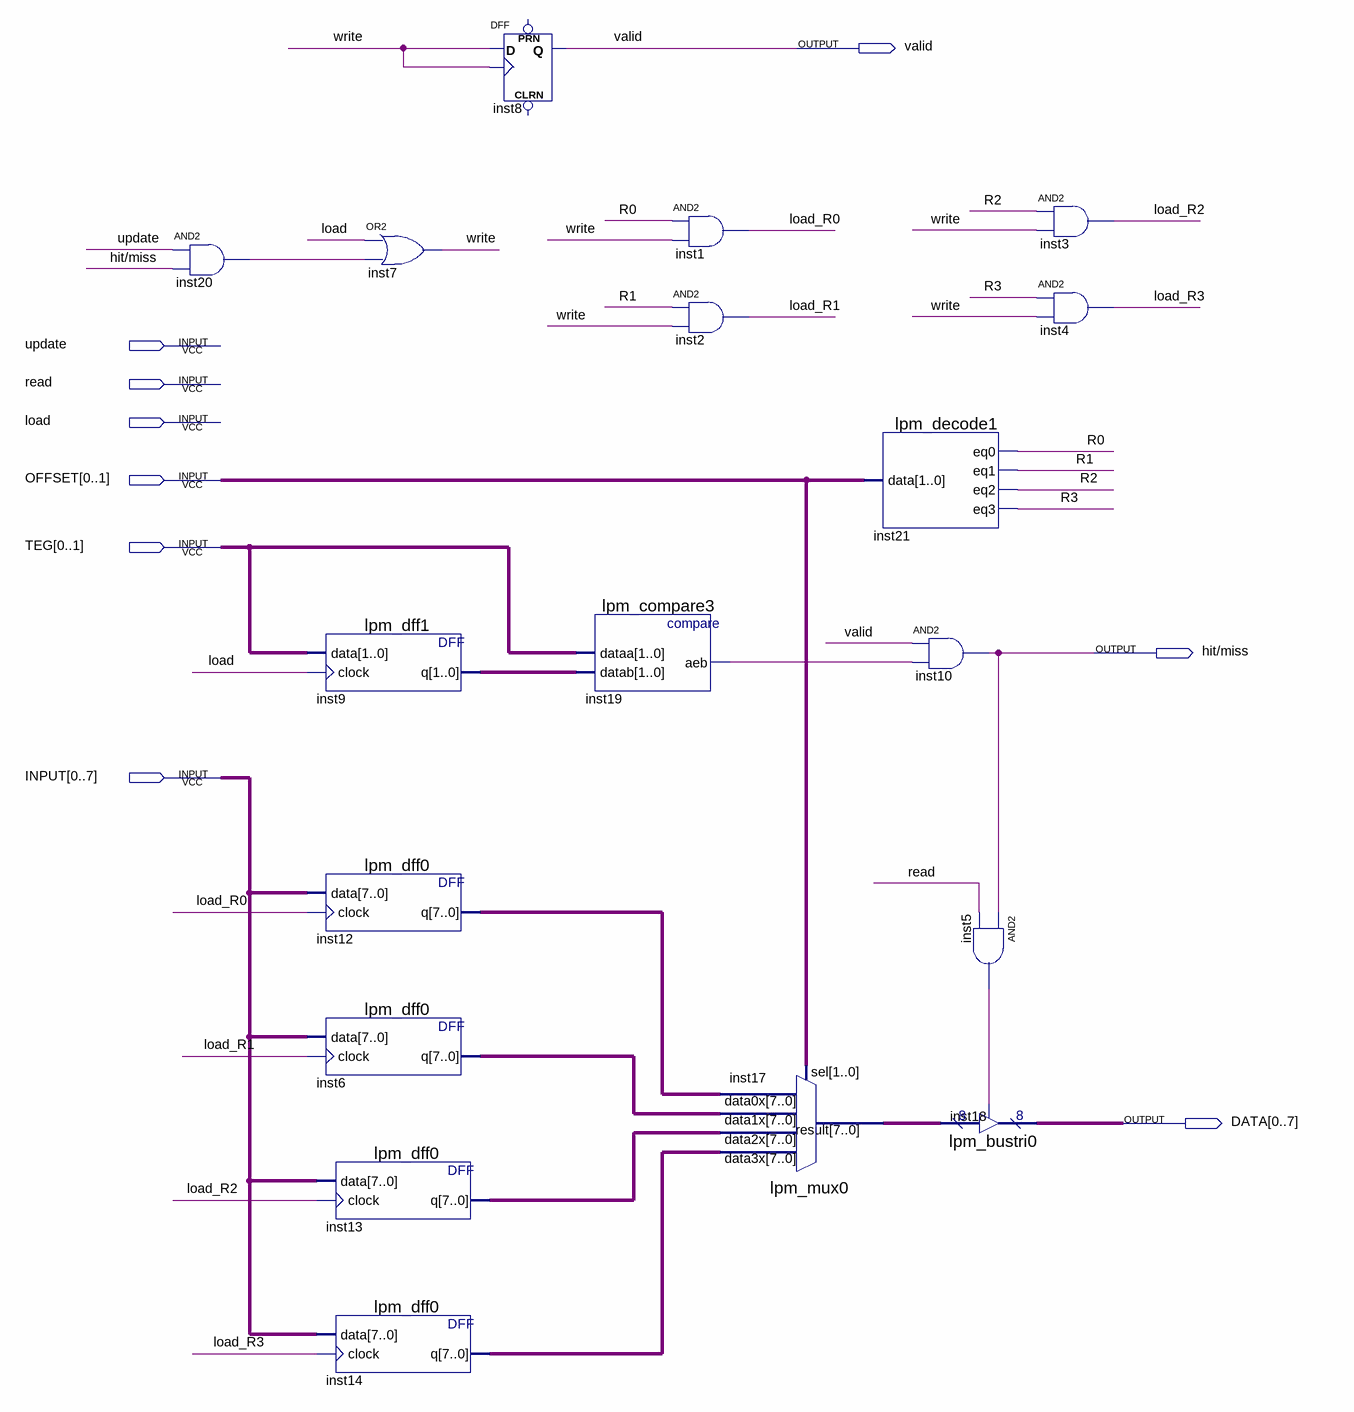
[diagram p0: schematic sheet]
// Quartus schematic ROW.bdf as structural Verilog: 18 symbols, 9 pins
module ROW (
  input  update,
  input  read,
  input  load,
  input  [0:1] OFFSET,
  input  [0:1] TEG,
  input  [0:7] INPUT,
  output valid,
  output \hit/miss ,
  output [0:7] DATA
);

  wire inst5_out, inst19_aeb, inst20_out, load_R0, load_R1, load_R2, load_R3, R0, R1, R2, R3, write;
  wire [1:0] inst9_q;
  wire [7:0] inst6_q, inst12_q, inst13_q, inst14_q, inst17_result;

  and inst20 (inst20_out, update, \hit/miss );
  or inst7 (write, load, inst20_out);
  lpm_dff1 inst9 (.data(TEG), .clock(load), .q(inst9_q));
  lpm_dff0 inst12 (.data(INPUT), .clock(load_R0), .q(inst12_q));
  lpm_dff0 inst6 (.data(INPUT), .clock(load_R1), .q(inst6_q));
  lpm_dff0 inst13 (.data(INPUT), .clock(load_R2), .q(inst13_q));
  lpm_dff0 inst14 (.data(INPUT), .clock(load_R3), .q(inst14_q));
  DFF inst8 (.CLK(write), .D(write), .Q(valid));  // open: CLRN, PRN
  lpm_compare3 inst19 (.dataa(TEG), .datab(inst9_q), .aeb(inst19_aeb));
  and inst1 (load_R0, R0, write);
  and inst2 (load_R1, R1, write);
  lpm_mux0 inst17 (
    .data3x(inst14_q), .data2x(inst13_q), .data1x(inst6_q), .data0x(inst12_q), .sel(OFFSET),
    .result(inst17_result));
  lpm_decode1 inst21 (.data(OFFSET), .eq0(R0), .eq1(R1), .eq2(R2), .eq3(R3));
  and inst10 (\hit/miss , valid, inst19_aeb);
  and inst5 (inst5_out, \hit/miss , read);
  lpm_bustri0 inst18 (.enabledt(inst5_out), .data(inst17_result), .tridata(DATA));
  and inst3 (load_R2, R2, write);
  and inst4 (load_R3, R3, write);
endmodule
